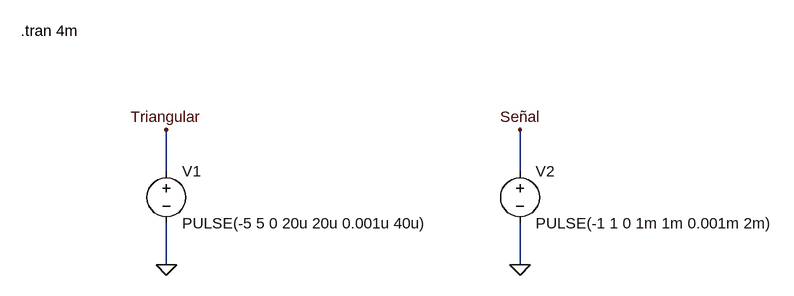
[diagram p0: schematic Draft1.asc]
Draft1.asc, the LTspice schematic file:
Version 4
SHEET 1 1056 680
WIRE 96 192 96 128
WIRE 640 192 640 128
WIRE 96 336 96 272
WIRE 640 336 640 272
FLAG 96 336 0
FLAG 96 128 Triangular
FLAG 640 336 0
FLAG 640 128 Señal
SYMBOL voltage 96 176 R0
SYMATTR InstName V1
SYMATTR Value PULSE(-5 5 0 20u 20u 0.001u 40u)
SYMBOL voltage 640 176 R0
SYMATTR InstName V2
SYMATTR Value PULSE(-1 1 0 1m 1m 0.001m 2m)
TEXT -128 -24 Left 2 !.tran 4m

The netlist it stands for:
* Draft1.asc
V1 Triangular 0 PULSE(-5 5 0 20u 20u 0.001u 40u)
V2 Señal 0 PULSE(-1 1 0 1m 1m 0.001m 2m)
.tran 4m
.backanno
.end